# Altium schematic sheet SCH_A4_Template.SchDoc
size A4
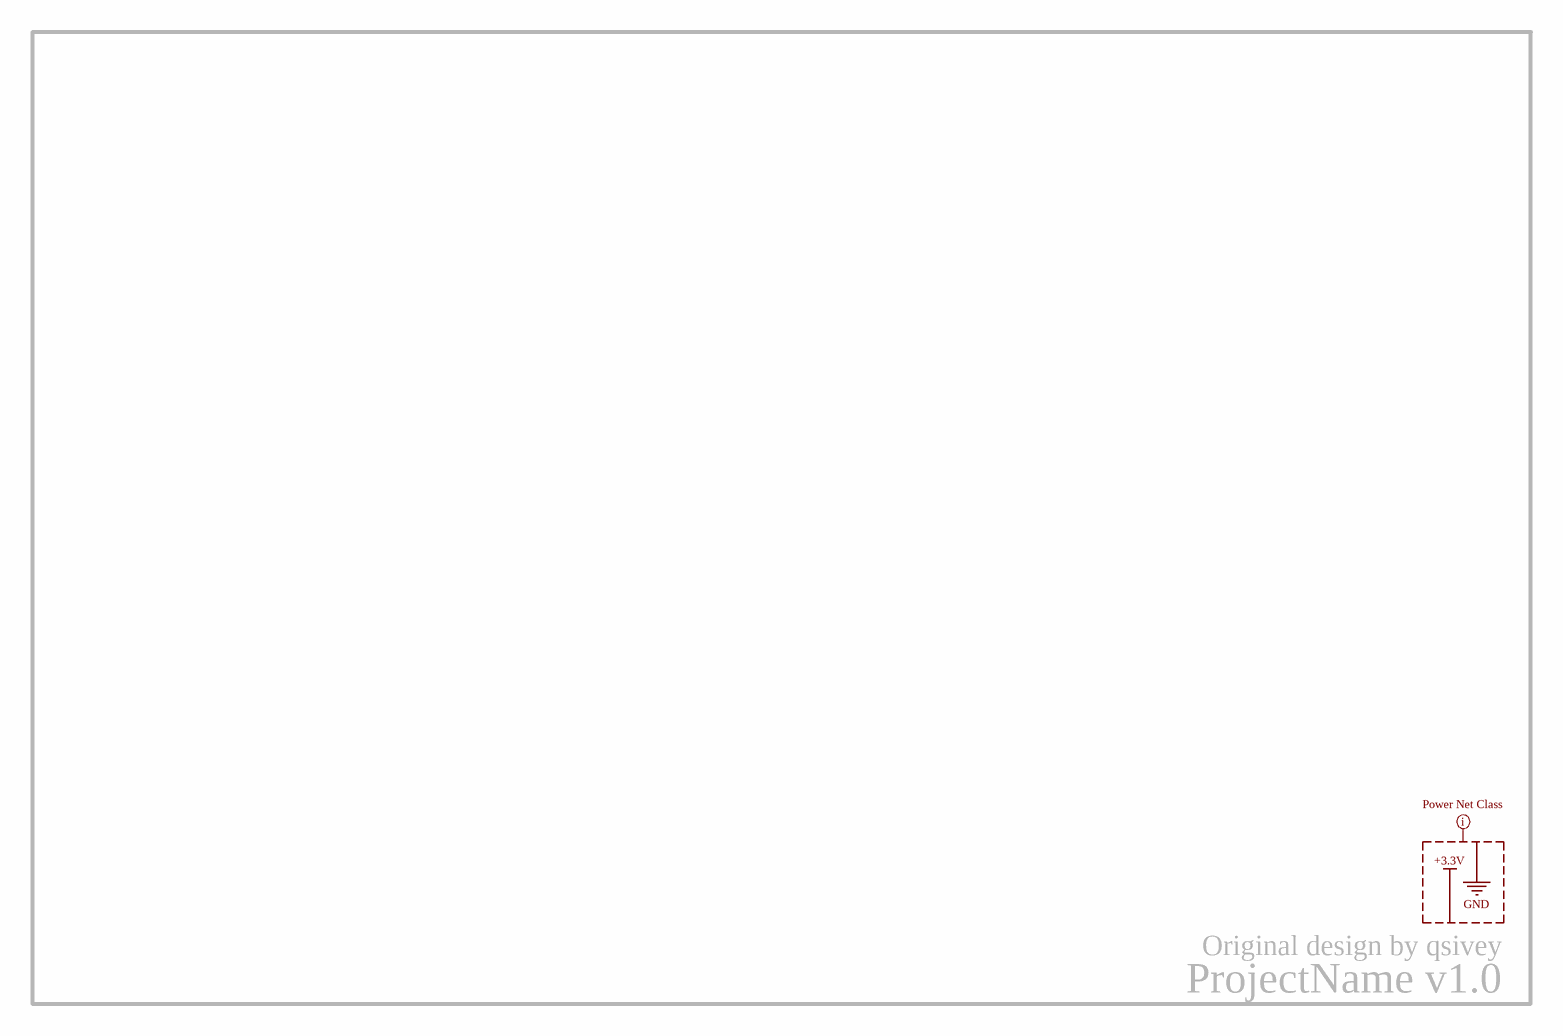
[diagram p0: SCH_A4_Template.SchDoc]

## Layout directives
net class Power: +3.3V, GND

## Notes on the sheet
- Original design by qsivey
- ProjectName v1.0